# Altium project Melon S3 FPGA.PrjPCB
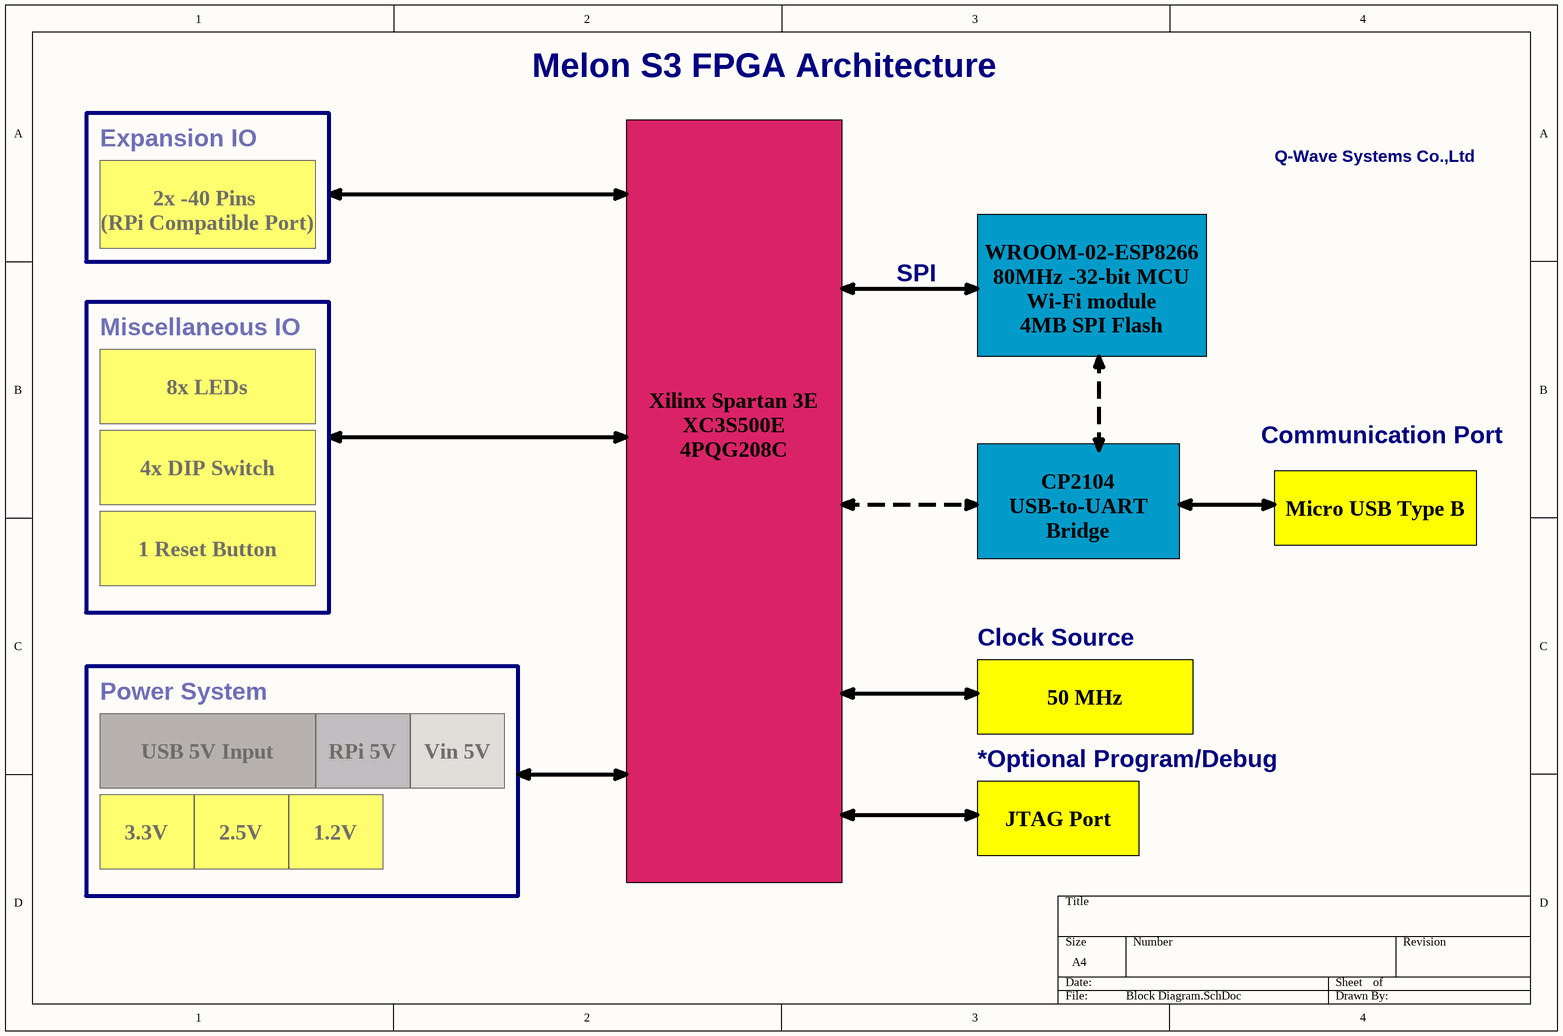
[diagram p0: Block Diagram.SchDoc]
3 sheets, 117 parts. Net scope: global (net labels, ports and power ports of the same name join across sheets).
Board file: Melon S3 FPGA.PcbDoc
Sheets:
  Block Diagram.SchDoc
  ESP-USB.SchDoc
  FPGA.SchDoc

## Sheet Block Diagram.SchDoc: Melon S3 FPGA
size A4; Organization: Q-Wave Systems Co.,Ltd; ProjectName: Melon S3

### Notes on the sheet
- Melon S3 FPGA Architecture
- Expansion IO
- Q-Wave Systems Co.,Ltd
- 2x -40 Pins
  (RPi Compatible Port)
- SPI
- Miscellaneous IO
- WROOM-02-ESP8266
  80MHz -32-bit MCU Wi-Fi module
  4MB SPI Flash
- 8x LEDs
- Communication Port
- 4x DIP Switch
- 1 Reset Button
- CP2104
  USB-to-UART Bridge
- Micro USB Type B
- Clock Source
- Power System
- USB 5V Input
- RPi 5V
- Vin 5V
- 50 MHz
- *Optional Program/Debug
- JTAG Port
- 3.3V
- 2.5V
- 1.2V
- Xilinx Spartan 3E
  XC3S500E
  4PQG208C

## Sheet ESP-USB.SchDoc
size C; SheetNumber: 0; SheetTotal: 0
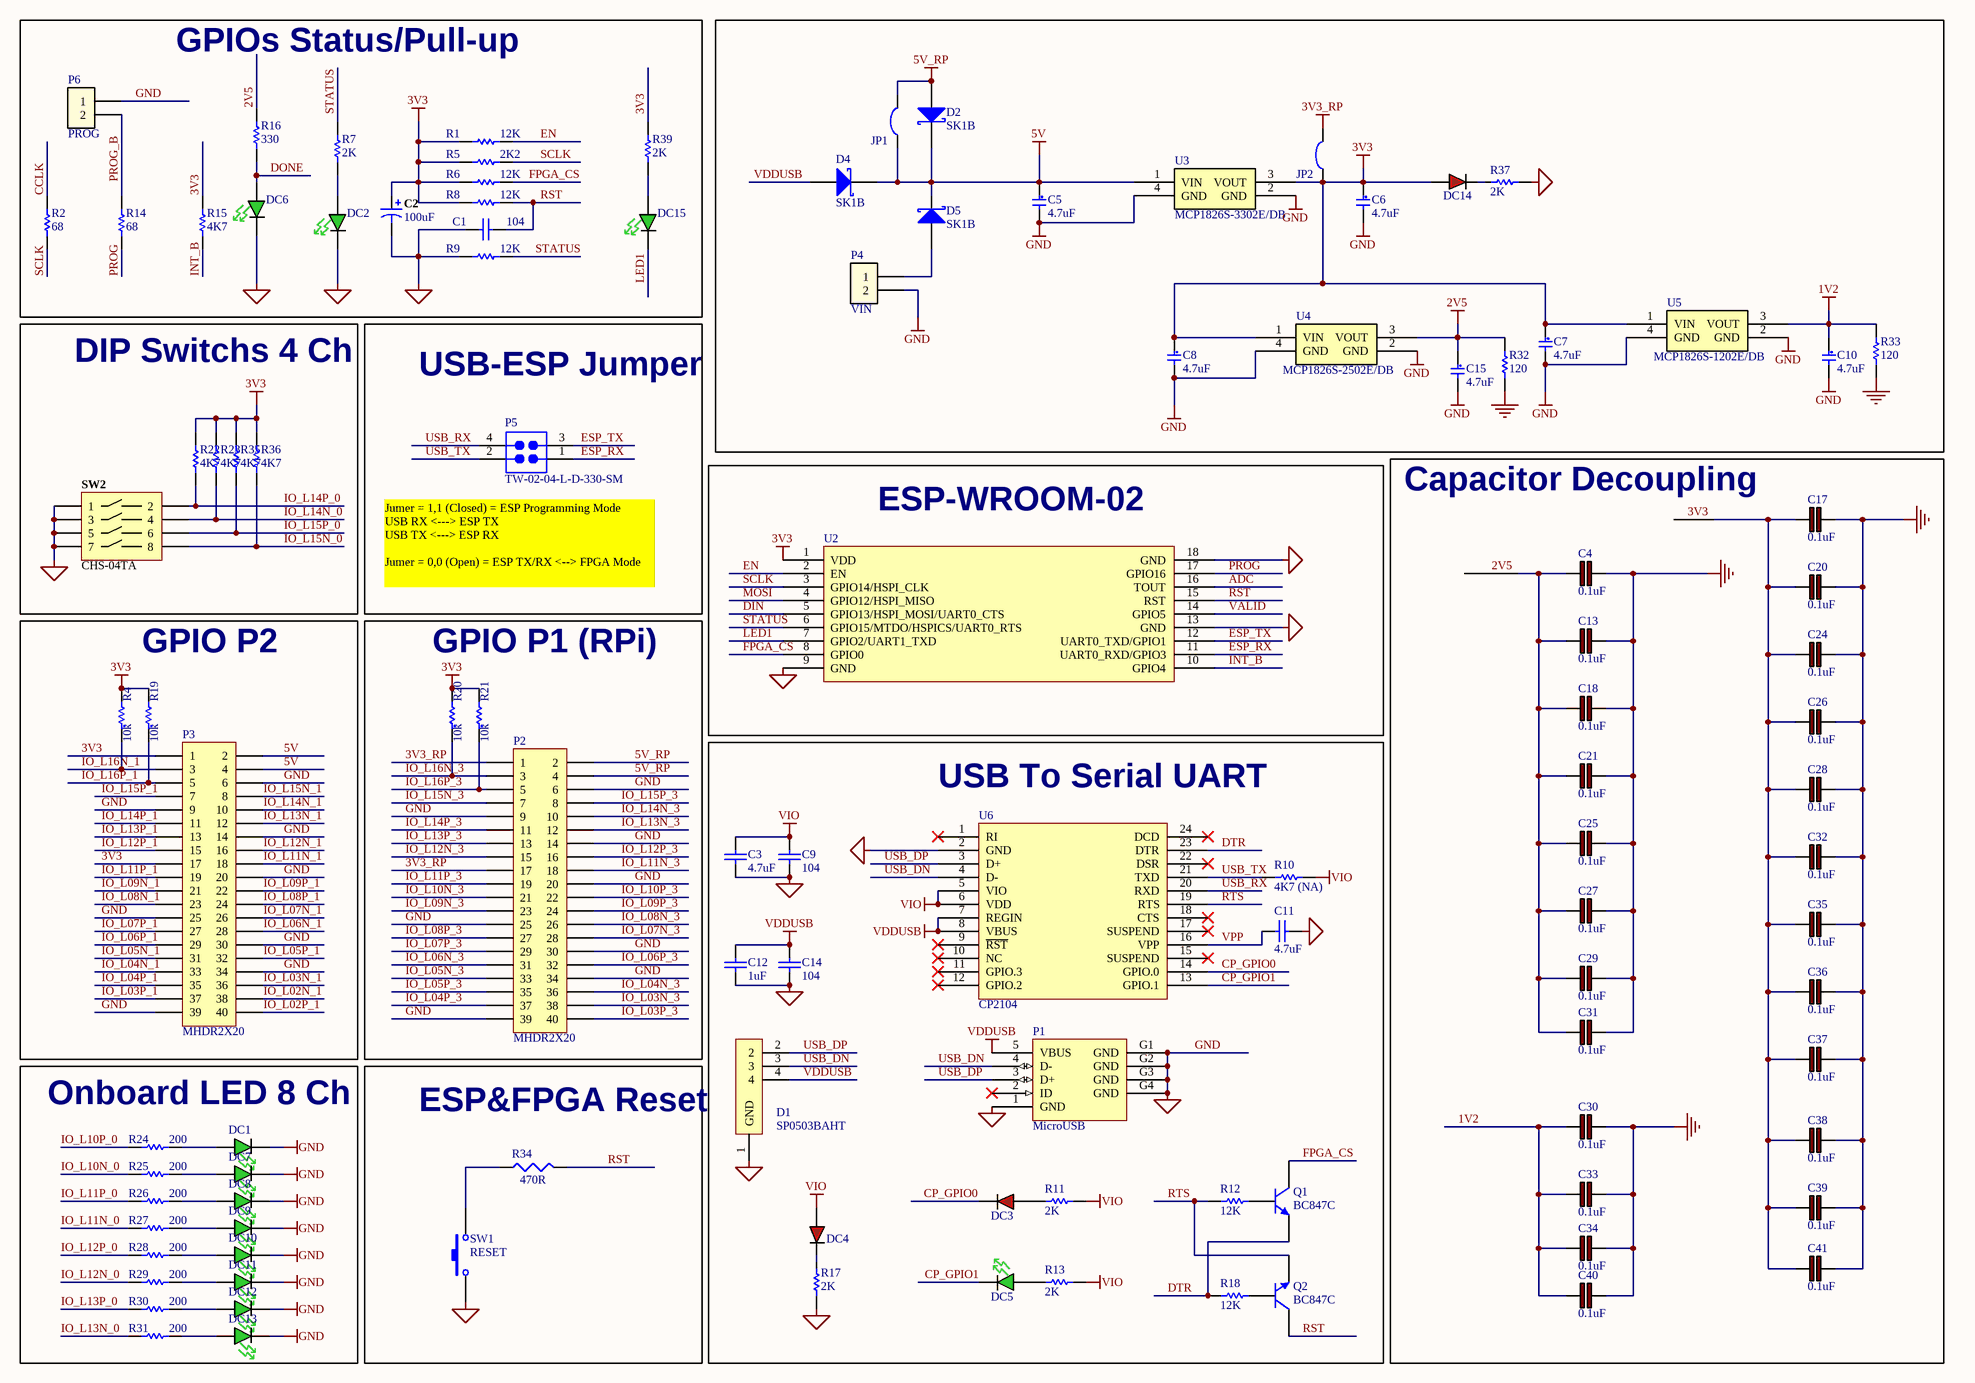
[diagram p1: ESP-USB.SchDoc]

### Parts
C1  104  [C0603 - Marked]
C2  Capacitance: 100uF  [AVX-CAPC3528_V]  (hidden comment: 100 uF Tantalum,)
C3  4.7uF  [C0603 - Marked]
C4  0.1uF  [C0603 - Marked]
C5  4.7uF  [C0603 - Marked]
C6  4.7uF  [C0603 - Marked]
C7  4.7uF  [C0603 - Marked]
C8  4.7uF  [C0603 - Marked]
C9  104  [C0603 - Marked]
C10  4.7uF  [C0603 - Marked]
C11  4.7uF  [C0603 - Marked]
C12  1uF  [C0603 - Marked]
C13  0.1uF  [C0603 - Marked]
C14  104  [C0603 - Marked]
C15  4.7uF  [C0603 - Marked]
C17  0.1uF  [C0603 - Marked]
C18  0.1uF  [C0603 - Marked]
C20  0.1uF  [C0603 - Marked]
C21  0.1uF  [C0603 - Marked]
C24  0.1uF  [C0603 - Marked]
C25  0.1uF  [C0603 - Marked]
C26  0.1uF  [C0603 - Marked]
C27  0.1uF  [C0603 - Marked]
C28  0.1uF  [C0603 - Marked]
C29  0.1uF  [C0603 - Marked]
C30  0.1uF  [C0603 - Marked]
C31  0.1uF  [C0603 - Marked]
C32  0.1uF  [C0603 - Marked]
C33  0.1uF  [C0603 - Marked]
C34  0.1uF  [C0603 - Marked]
C35  0.1uF  [C0603 - Marked]
C36  0.1uF  [C0603 - Marked]
C37  0.1uF  [C0603 - Marked]
C38  0.1uF  [C0603 - Marked]
C39  0.1uF  [C0603 - Marked]
C40  0.1uF  [C0603 - Marked]
C41  0.1uF  [C0603 - Marked]
D1  SP0503BAHT  [SOT143-4]
D2  SK1B  [EDIS_SMA]
D4  SK1B  [EDIS_SMA]
D5  SK1B  [EDIS_SMA]
DC1  (no value)  [LED_0603 - GREEN]
DC2  (no value)  [LED_0603 - GREEN]
DC3  598-8010-107F  [LED_0603 - RED]  (value not drawn)
DC4  598-8010-107F  [LED_0603 - RED]  (value not drawn)
DC5  (no value)  [LED_0603 - GREEN]
DC6  (no value)  [LED_0603 - GREEN]
DC7  (no value)  [LED_0603 - GREEN]
DC8  (no value)  [LED_0603 - GREEN]
DC9  (no value)  [LED_0603 - GREEN]
DC10  (no value)  [LED_0603 - GREEN]
DC11  (no value)  [LED_0603 - GREEN]
DC12  (no value)  [LED_0603 - GREEN]
DC13  (no value)  [LED_0603 - GREEN]
DC14  598-8010-107F  [LED_0603 - RED]  (value not drawn)
DC15  (no value)  [LED_0603 - GREEN]
JP1  Solder Jumper  [SOLDER_JUMPER]  (value not drawn)  (no BOM)
JP2  Solder Jumper  [SOLDER_JUMPER]  (value not drawn)  (no BOM)
P1  MicroUSB  [MICRO-USB-CON]
P2  MHDR2X20  [Raspberry Con]
P3  MHDR2X20  [Raspberry Con]
P4  VIN  [HEADER_2_40_100 THRU SIP]  (no BOM)
P5  TW-02-04-L-D-330-SM  [SMTC-TW-02-04-X-D-330-SM]
P6  PROG  [HEADER_2_40_100 THRU SIP]  (no BOM)
Q1  BC847C  [SOT-23]
Q2  BC847C  [SOT-23]
R1  12K  [R0603]
R2  68  [R0603]
R4  10k  [R0603]
R5  2K2  [R0603]
R6  12K  [R0603]
R7  2K  [R0603]
R8  12K  [R0603]
R9  12K  [R0603]
R10  4K7 (NA)  [R0603]
R11  2K  [R0603]
R12  12K  [R0603]
R13  2K  [R0603]
R14  68  [R0603]
R15  4K7  [R0603]
R16  330  [R0603]
R17  2K  [R0603]
R18  12K  [R0603]
R19  10k  [R0603]
R20  10k  [R0603]
R21  10k  [R0603]
R22  4K7  [R0603]
R23  4K7  [R0603]
R24  200  [R0603]
R25  200  [R0603]
R26  200  [R0603]
R27  200  [R0603]
R28  200  [R0603]
R29  200  [R0603]
R30  200  [R0603]
R31  200  [R0603]
R32  120  [R0603]
R33  120  [R0603]
R34  value 470R  [J1-0603]  (hidden comment: 470)
R35  4K7  [R0603]
R36  4K7  [R0603]
R37  2K  [R0603]
R39  2K  [R0603]
SW1  RESET  [SW_MINI]
SW2  CHS-04TA  [EHS104L]
U2  ESP8266_WROOM_02  [ESP WROOM02-Fit Size]  (value not drawn)
U3  MCP1826S-3302E/DB  [SOT223]
U4  MCP1826S-2502E/DB  [SOT223]
U5  MCP1826S-1202E/DB  [SOT223]
U6  CP2104  [QFN24 - duplicate]

### Blocks framed on the sheet
GPIOs Status/Pull-up: C1 C2 DC2 DC6 DC15 P6 R1 R2 R5-R9 R14-R16 R39
DIP Switchs 4 Ch: R22 R23 R35 R36 SW2
USB-ESP Jumper: P5
ESP-WROOM-02: U2
Capacitor Decoupling: C4 C13 C17 C18 C20 C21 C24-C41
GPIO P2: P3 R4 R19
GPIO P1 (RPi): P2 R20 R21
USB To Serial UART: C3 C9 C11 C12 C14 D1 DC3-DC5 P1 Q1 Q2 R10-R13 R17 R18 U6
Onboard LED 8 Ch: DC1 DC7-DC13 R24-R31
ESP&FPGA Reset: R34 SW1

### Nets
1V2: C10.1 C30.1 C33.1 C34.1 C40.1 R33.1 U5.3(VOUT)
2V5: C4.1 C13.1 C15.1 C18.1 C21.1 C25.1 C27.1 C29.1 C31.1 R16.1 R32.1 U4.3(VOUT)
3V3: C2.1 C6.1 C7.1 C8.1 C17.1 C20.1 C24.1 C26.1 C28.1 C32.1 C35.1 C36.1 C37.1 C38.1 C39.1 C41.1 DC14.A JP2.2 P3.1 P3.17 R1.2 R4.2 R5.2 R6.2 R8.2 R15.1 R19.2 R20.2 R21.2 R22.1 R23.1 R35.1 R36.1 R39.1 U2.1(VDD) U3.3(VOUT) U4.1(VIN) U5.1(VIN)
3V3_RP: JP2.1 P2.1 P2.17
5V: C5.1 D2.2(K) D4.2(K) D5.2(K) JP1.2 P3.2 P3.4 U3.1(VIN)
5V_RP: D2.1(A) JP1.1 P2.2 P2.4
GND: C1.1 C2.2 C3.2 C4.2 C5.2 C6.2 C7.2 C8.2 C9.2 C10.2 C11.2 C12.2 C13.2 C14.2 C15.2 C17.2 C18.2 C20.2 C21.2 C24.2 C25.2 C26.2 C27.2 C28.2 C29.2 C30.2 C31.2 C32.2 C33.2 C34.2 C35.2 C36.2 C37.2 C38.2 C39.2 C40.2 C41.2 D1.1(GND) DC1.C DC2.C DC6.C DC7.C DC8.C DC9.C DC10.C DC11.C DC12.C DC13.C P1.1(GND) P1.G1(GND) P1.G2(GND) P1.G3(GND) P1.G4(GND) P2.6 P2.9 P2.14 P2.20 P2.25 P2.30 P2.34 P2.39 P3.6 P3.9 P3.14 P3.20 P3.25 P3.30 P3.34 P3.39 P4.2 P6.1 R9.2 R17.1 R32.2 R33.2 R37.1 SW1.1 SW2.1 SW2.3 SW2.5 SW2.7 U2.9(GND) U2.13(GND) U2.18(GND) U3.2(GND) U3.4(GND) U4.2(GND) U4.4(GND) U5.2(GND) U5.4(GND) U6.2(GND)  [also labelled DGND]
VDDUSB: C12.1 C14.1 D1.4 D4.1(A) P1.5(VBUS) U6.7(REGIN) U6.8(VBUS)
VIO: C3.1 C9.1 DC4.A R10.2 R11.2 R13.2 U6.5(VIO) U6.6(VDD)
ADC: U2.16(TOUT)
CCLK: R2.1
CP_GPIO0: DC3.C U6.14(GPIO.0)
CP_GPIO1: DC5.C U6.13(GPIO.1)
DIN: U2.5(GPIO13/HSPI_MOSI/UART0_CTS)
DONE: DC6.A R16.2
DTR: Q1.2(E) R18.2 U6.23(DTR)
EN: R1.1 U2.2(EN)
ESP_RX: P5.1 U2.11(UART0_RXD/GPIO3)
ESP_TX: P5.3 U2.12(UART0_TXD/GPIO1)
FPGA_CS: Q1.3(C) R6.1 U2.8(GPIO0)
INT_B: R15.2 U2.10(GPIO4)
IO_L02N_1: P3.38
IO_L02P_1: P3.40
IO_L03N_1: P3.36
IO_L03N_3: P2.38
IO_L03P_1: P3.37
IO_L03P_3: P2.40
IO_L04N_1: P3.33
IO_L04N_3: P2.36
IO_L04P_1: P3.35
IO_L04P_3: P2.37
IO_L05N_1: P3.31
IO_L05N_3: P2.33
IO_L05P_1: P3.32
IO_L05P_3: P2.35
IO_L06N_1: P3.28
IO_L06N_3: P2.31
IO_L06P_1: P3.29
IO_L06P_3: P2.32
IO_L07N_1: P3.26
IO_L07N_3: P2.28
IO_L07P_1: P3.27
IO_L07P_3: P2.29
IO_L08N_1: P3.23
IO_L08N_3: P2.26
IO_L08P_1: P3.24
IO_L08P_3: P2.27
IO_L09N_1: P3.21
IO_L09N_3: P2.23
IO_L09P_1: P3.22
IO_L09P_3: P2.24
IO_L10N_0: R25.2
IO_L10N_3: P2.21
IO_L10P_0: R24.2
IO_L10P_3: P2.22
IO_L11N_0: R27.2
IO_L11N_1: P3.18
IO_L11N_3: P2.18
IO_L11P_0: R26.2
IO_L11P_1: P3.19
IO_L11P_3: P2.19
IO_L12N_0: R29.2
IO_L12N_1: P3.16
IO_L12N_3: P2.15
IO_L12P_0: R28.2
IO_L12P_1: P3.15
IO_L12P_3: P2.16
IO_L13N_0: R31.2
IO_L13N_1: P3.12
IO_L13N_3: P2.12
IO_L13P_0: R30.2
IO_L13P_1: P3.13
IO_L13P_3: P2.13
IO_L14N_0: R23.2 SW2.4
IO_L14N_1: P3.10
IO_L14N_3: P2.10
IO_L14P_0: R22.2 SW2.2
IO_L14P_1: P3.11
IO_L14P_3: P2.11
IO_L15N_0: R36.2 SW2.8
IO_L15N_1: P3.8
IO_L15N_3: P2.7
IO_L15P_0: R35.2 SW2.6
IO_L15P_1: P3.7
IO_L15P_3: P2.8
IO_L16N_1: P3.3 R4.1
IO_L16N_3: P2.3 R20.1
IO_L16P_1: P3.5 R19.1
IO_L16P_3: P2.5 R21.1
LED1: DC15.C U2.7(GPIO2/UART1_TXD)
MOSI: U2.4(GPIO12/HSPI_MISO)
PROG: R14.2 U2.17(GPIO16)
PROG_B: P6.2 R14.1
RST: C1.2 Q2.3(C) R8.1 R34.2 U2.15(RST)
RTS: Q2.2(E) R12.2 U6.19(RTS)
SCLK: R2.2 R5.1 U2.3(GPIO14/HSPI_CLK)
STATUS: R7.1 R9.1 U2.6(GPIO15/MTDO/HSPICS/UART0_RTS)
USB_DN: D1.3 P1.4(D-) U6.4(D-)
USB_DP: D1.2 P1.3(D+) U6.3(D+)
USB_RX: P5.4 U6.20(RXD)
USB_TX: P5.2 R10.1 U6.21(TXD)
VALID: U2.14(GPIO5)
VPP: C11.1 U6.16(VPP)
NetD5_1: D5.1(A) P4.1
NetDC1_A: DC1.A R24.1
NetDC2_A: DC2.A R7.2
NetDC3_A: DC3.A R11.1
NetDC4_C: DC4.C R17.2
NetDC5_A: DC5.A R13.1
NetDC7_A: DC7.A R25.1
NetDC8_A: DC8.A R26.1
NetDC9_A: DC9.A R27.1
NetDC10_A: DC10.A R28.1
NetDC11_A: DC11.A R29.1
NetDC12_A: DC12.A R30.1
NetDC13_A: DC13.A R31.1
NetDC14_C: DC14.C R37.2
NetDC15_A: DC15.A R39.2
NetQ1_1: Q1.1(B) R12.1
NetQ2_1: Q2.1(B) R18.1
NetR34_1: R34.1 SW1.2

Not connected (* = marked no-connect by the designer): P1 2(ID)*; U6 1(RI)* 9(~{RST})* 10(NC)* 11(GPIO.3)* 12(GPIO.2)* 15(SUSPEND)* 17(SUSPEND)* 18(CTS)* 22(DSR)* 24(DCD)*

### Notes on the sheet
- (near P5) Jumer = 1,1 (Closed) = ESP Programming Mode
  USB RX <---> ESP TX
  USB TX <---> ESP RX
  Jumer = 0,0 (Open) = ESP TX/RX <--> FPGA Mode

### Library data of the parts
C1 C9 C14 = Cap Semi: Capacitor 0603; MFG: KEMET; MFG P/N: C0603C104J5RACTU; Supplier1: ES; Supplier1 Price: 0.6
C2 = CMP-0279-00001-1: Capacitor, Tantalum, 100uF 10% 20V MCCT-B (3528); PartNumber: TAJB106K020R; Manufacturer: AVX; Polarity: Polarized; PackageDescription: 2-Pin SMT Capacitor, 3.5 x 2.8 mm Body; ComponentLink1URL: http://www.avx.com/; PackageReference: CAPC3528; ComponentLink2Description: Datasheet; Technology: Tantalum; ComponentLink2URL: http://www.avx.com/docs/Catalogs/taj.pdf; Tolerance: 10%; ComponentLink1Description: Manufacturer URL; Rated Voltage: 20V; DatasheetVersion: Jun-13; Mounting Technology: Surface Mount; Manufacturer_PN: TAJB106K020R; Manufacturer Part Number: TAJB106K020R
C3 C11 = Cap: Capacitor 0603; MFG: KEMET; MFG P/N: C0603C475K8PACTU; Supplier1: ES; Supplier1 Price: 1.86
C4 C13 C17 C18 C20 C21 C24-C41 = CAP: Capacitor
C5-C8 C10 C15 = C0603 - GRM188R60J475KE19D: 4.7uF 6.3volts X5R 10% (MLCC) - SMD/SMT 0603; Manufacturer: Murata Electronics North America; Capacitance: 4.7µF; Voltage - Rated: 6.3V; Value: 4.7uF; Supplier 1: Digi-Key; Supplier Part Number 1: 490-3297-1-ND; Manufacturer Part Number: GRM188R60J475KE19D; RoHS: RoHS Compliant; Category: Capacitors; Stock 1: 614848; Pricing 1: 1=0.19, 10=0.132, 50=0.076, 100=0.0627, 250=0.05284, 500=0.04426, 1000=0.03633 (USD); Tolerance: ±10%; Package / Case: 0603 (1608 Metric); Packaging: Cut Tape (CT); ComponentLink1URL: http://search.murata.co.jp/Ceramy/image/img/PDF/ENG/GRM188R60J475KE19.pdf; ComponentLink1Description: http://search.murata.co.jp/Ceramy/image/img/PDF/ENG/GRM188R60J475KE19.pdf; Temperature Coefficient: X5R; Mounting Type: Surface Mount, MLCC; Operating Temperature: -55°C ~ 85°C; Applications: General Purpose; Ratings: -; Size / Dimension: 0.063" L x 0.031" W (1.60mm x 0.80mm); Height - Seated (Max): -; Thickness (Max): 0.035" (0.90mm); Lead Spacing: -; Features: -; Lead Style: -
C12 = Cap Semi: Capacitor 0603; MFG: KEMET; MFG P/N: GRM188R61H105KAALD; Supplier1: ES; Supplier1 Price: 1.31
D1 = SP0503BAHT: TVS DIODE 5.5VWM 8.5VC SOT143; MFG P/N: SP0503BAHTG; MFG: GTK; Supplier1: Digikey; Supplier1 Price: 24.28
D2 D4 D5 = D Schottky: Schottky Diode; MFG: EIC; Supplier1: ES; Supplier1 Price: 3.01; MFG P/N: SK1B
DC1 DC2 DC5-DC13 DC15 = APT1608CGCK: LED 1.6X0.8MM 570NM GRN CLR SMD; Manufacturer: Kingbright Corp; Current - Test: 20mA; Wavelength - Peak: 574nm; Millicandela Rating: 50mcd; Voltage - Forward (Vf) Typ: 2.1V; Lens Type: Clear; Lens Style/Size: Rectangle with Flat Top, 1.2mm x 0.8mm; Viewing Angle: 120°; Supplier 1: Digi-Key; Supplier Part Number 1: 754-1116-1-ND; Manufacturer Part Number: APT1608CGCK; RoHS: RoHS Compliant; Category: Optoelectronics; Stock 1: 98122; Pricing 1: 1=0.2, 10=0.153, 25=0.1224, 100=0.1105, 250=0.102, 500=0.0918 (USD); Color: Green; Luminous Flux @ Current - Test: -; Wavelength - Dominant: 570nm; Size / Dimension: 1.60mm L x 0.80mm W; Height: 0.75mm; Package / Case: 0603 (1608 Metric); Mounting Type: Surface Mount; Packaging: Cut Tape (CT); ComponentLink1URL: http://www.us.kingbright.com/images/catalog/SPEC/APT1608CGCK.pdf; ComponentLink1Description: http://www.us.kingbright.com/images/catalog/SPEC/APT1608CGCK.pdf
DC3 DC4 DC14 = LED0603 - 598-8010-107F: LED ALINGAP RED CLEAR 0603 SMD; Manufacturer: Dialight; Current - Test: 20mA; Wavelength - Dominant: 635nm; Millicandela Rating: 40mcd; Voltage - Forward (Vf) Typ: 2.2V; Lens Style/Size: Rectangle with Flat Top, 1.1mm x 0.8mm; Viewing Angle: 140°; Accept Replacement: YES - Water Clear; Supplier 1: Digi-Key; Manufacturer Part Number: 598-8010-107F; RoHS: RoHS Compliant; Category: Optoelectronics; Stock 1: 37578; Pricing 1: 1=0.45, 10=0.33, 25=0.264, 100=0.1749, 250=0.1452, 500=0.1056, 1000=0.0825 (USD); Color: Red; Luminous Flux @ Current - Test: -; Wavelength - Peak: -; Lens Type: Clear; Size / Dimension: 1.60mm L x 0.80mm W; Height: 0.70mm; Package / Case: 0603 (1608 Metric); Mounting Type: Surface Mount; Packaging: Digi-Reel®; ComponentLink1URL: http://media.digikey.com/pdf/Data%20Sheets/Dialight%20PDFs/598_Series_0603_Pkg.pdf; ComponentLink1Description: http://media.digikey.com/pdf/Data%20Sheets/Dialight%20PDFs/598_Series_0603_Pkg.pdf; Supplier Part Number 1: 350-2029-6-ND
JP1 JP2 = Solder Jumper: Solder/Configuration Jumper; Manufacturer: n/a; Manufacturer Part Number: n/a; Source: n/a; Source Part Number: n/a; ROHS Certificate: n/a
P1 = ESOC004: Micro USB 5Pins,Female B type Right Angle, SMT; MFG P/N: MRUMRB05FTKTY-30U; MFG: GTK; Supplier1: ES; Supplier1 Price: 15.35
P2 P3 = MHDR2X20: Header, 20-Pin, Dual row; LatestRevisionDate: 17-Jul-2002; LatestRevisionNote: Re-released for DXP Platform.; Publisher: Altium Limited
P4 P6 = Header2: Header 2 pin
P5 = CMP-1029-00319-1: SMT Board Stacker, Vertical, -55 to 125 degC, 2 mm Pitch, 4-Pin, Male, RoHS; Manufacturer: Samtec; Pitch: 2 mm; PackageDescription: High Temp 2mm SMT Board Stacking Terminal Strip ASM; ComponentLink1Description: Manufacturer URL; PackageVersion: CL, 3/1993; ComponentLink3URL: http://www.samtec.com/documents/webfiles/cpdf/TW-XX-XX-XXX-X-XXX-SM-XXX-XX-MKT1.pdf; Temperature Range: -55 to 125 degC; Orientation: Vertical; ComponentLink2Description: Datasheet; RoHS: True; ComponentLink1URL: http://www.samtec.com; ComponentLink3Description: Package Specification; DatasheetVersion: F-214; PartNumber: TW-02-04-L-D-330-SM; PackageReference: TW-02-04-X-D-330-SM; ComponentLink2URL: http://d2a072wq521u33.cloudfront.net/catalog_english//TW_SM.PDF; Mounting Technology: Surface Mount
Q1 Q2 = NPN: NPN Bipolar Transistor; MFG: PHILIPS/NXP; MFG P/N: BC847C,215; Supplier1: ES; Supplier1 Price: 0.53
R1 R2 R6-R9 R12 R14-R16 R18 R22 R23 R32 R33 R35 R36 R39 = Res Semi: Resistor 0603; MFG: ROHM; MFG P/N: MCR03ERTF1202; Supplier1: Digikey; Supplier1 Price: 0.4
R4 R19-R21 = R0603 - CRCW060310K0FKEA: 10k Thick Film Resistors - SMD 1/10watt 10Kohms 1%; Manufacturer: Vishay Dale; Power (Watts): 0.1W, 1/10W; Temperature Coefficient: ±100ppm/°C; Manufacturer Part Number: CRCW060310K0FKEA; Value: 10k; Supplier 1: Digi-Key; RoHS: RoHS Compliant; Category: Resistors; Stock 1: 997856; Pricing 1: 10=0.081, 50=0.0436, 200=0.0251, 1000=0.01711 (USD); Resistance (Ohms): 10K; Composition: Thick Film; Features: -; Tolerance: ±1%; Size / Dimension: 0.061" L x 0.033" W (1.55mm x 0.85mm); Height: 0.020" (0.50mm); Packaging: Cut Tape (CT); Package / Case: 0603 (1608 Metric); ComponentLink1URL: http://www.vishay.com/doc?20035; ComponentLink1Description: http://www.vishay.com/doc?20035; Supplier Part Number 1: 541-10.0KHCT-ND; Number of Terminations: 2
R5 = Res Semi: Resistor 0603; MFG: ROHM; MFG P/N: MCR03ERTF2201; Supplier1: Digikey; Supplier1 Price: 0.4
R10 = Res Semi: Resistor 0603; MFG P/N: NA
R11 R13 R17 R37 = Res Semi: Resistor 0603; MFG: ROHM; MFG P/N: MCR03ERTF2001; Supplier1: Digikey; Supplier1 Price: 0.4
R24-R31 = ERJ-3EKF2000V: RES 200 OHM 1/10W 1% 0603 SMD; Manufacturer: Panasonic - ECG; Power (Watts): 0.1W, 1/10W; Temperature Coefficient: ±100ppm/°C; Manufacturer Part Number: ERJ-3EKF2000V; Value: RES 200 OHM 1/10W 1% 0603 SMD; Supplier 1: Digi-Key; Supplier Part Number 1: P200HCT-ND; RoHS: RoHS Compliant; Category: Resistors; Stock 1: 1279595; Pricing 1: 1=0.04, 50=0.015, 100=0.0114, 250=0.00844, 500=0.00624, 1000=0.00416 (USD); Resistance (Ohms): 200; Composition: Thick Film; Features: -; Tolerance: ±1%; Size / Dimension: 0.063" L x 0.031" W (1.60mm x 0.80mm); Height: 0.018" (0.45mm); Lead Style: Surface Mount (SMD - SMT); Packaging: Cut Tape (CT); Package / Case: 0603 (1608 Metric); ComponentLink1URL: http://industrial.panasonic.com/www-cgi/jvcr13pz.cgi?E+PZ+3+AOA0002+ERJ3EKF2000V+7+WW; ComponentLink1Description: http://industrial.panasonic.com/www-cgi/jvcr13pz.cgi?E+PZ+3+AOA0002+ERJ3EKF2000V+7+WW
R34 = Res3: Resistor; Published: 8-Jun-2000; LatestRevisionDate: 29-May-2009; LatestRevisionNote: IPC-7351 Footprint Added.; PackageReference: J1-0603; Publisher: Altium Limited; PackageDescription: Chip Resistor
SW1 = SW-PB: Tact Switch; MFG: ALPS; MFG P/N: SKRKAHE010; Supplier1: Mouser; Supplier1 Price: 19.06
SW2 = CHS-04TA: SWITCH DIP 4-POS SLIDE SMD 6V; Manufacturer: Copal Electronics Inc; Circuit: SPST; Number of Positions: 4; Contact Rating @ Voltage: 0.1A @ 6VDC; Actuator Type: Standard; Actuator Level: Flush; Washable: Yes; Supplier 1: Digi-Key; Manufacturer Part Number: CHS-04TA; RoHS: RoHS Compliant; Category: Switches; Stock 1: 2000; Pricing 1: 500=1.33876, 1000=1.1475, 5000=1.05188 (USD); Mounting Type: Surface Mount; Orientation: Top Actuated; ComponentLink1URL: http://copal-electronics.info/en/0008e/0267f.pdf; ComponentLink1Description: http://copal-electronics.info/en/0008e/0267f.pdf; Supplier Part Number 1: 563-1007-2-ND; Manufacturer_PN: CHS-04TA
U2 = ESP8266 WROOM 02: WiFi Serial Transceiver Module (ESP8266); MFG P/N: ESP-WROOM-02; MFG: ESPRESSIF; Supplier1 Price: 95.34; Supplier1: stock
U3 = REG - MCP1826S-3302E/DB: LDO REG 1A 3.3V SOT223-3; Manufacturer: Microchip Technology; Regulator Topology: Positive Fixed; Voltage - Input: Up to 6V; Voltage - Dropout (Typical): 0.25V @ 1A; Number of Regulators: 1; Current - Output: 1A (Min); Value: MCP1826S-3302E/DB; Supplier 1: Digi-Key; Supplier Part Number 1: MCP1826S-3302E/DB-ND; Manufacturer Part Number: MCP1826S-3302E/DB; RoHS: RoHS Compliant; Category: Integrated Circuits (ICs); Stock 1: 2041; Pricing 1: 1=0.74, 10=0.68, 25=0.57, 100=0.52 (USD); Voltage - Output: 3.3V; Current - Limit (Min): -; Operating Temperature: -40°C ~ 125°C; Mounting Type: Surface Mount; Package / Case: TO-261-4, TO-261AA; Supplier Device Package: SOT-223-3; Packaging: Tube; ComponentLink1URL: http://ww1.microchip.com/downloads/en/DeviceDoc/22057a.pdf; ComponentLink1Description: http://ww1.microchip.com/downloads/en/DeviceDoc/22057a.pdf
U4 = MCP1826S-1202E/DB: IC LDO REG 1A 2.5V SOT223-3; Manufacturer: Microchip Technology; Regulator Topology: Positive Fixed; Voltage - Input: Up to 6V; Voltage - Dropout (Typical): 0.25V @ 1A; Number of Regulators: 1; Current - Output: 1A (Min); Value: MCP1826S-2502E/DB; Supplier 1: Digi-Key; Supplier Part Number 1: MCP1826S-2502E/DB-ND; Manufacturer Part Number: MCP1826S-1202E/DB; RoHS: RoHS Compliant; Category: Integrated Circuits (ICs); Stock 1: 2041; Pricing 1: 1=0.74, 10=0.68, 25=0.57, 100=0.52 (USD); Voltage - Output: 2.5V; Current - Limit (Min): -; Operating Temperature: -40°C ~ 125°C; Mounting Type: Surface Mount; Package / Case: TO-261-4, TO-261AA; Supplier Device Package: SOT-223-3; Packaging: Tube; ComponentLink1URL: http://ww1.microchip.com/downloads/en/DeviceDoc/22057a.pdf; ComponentLink1Description: http://ww1.microchip.com/downloads/en/DeviceDoc/22057a.pdf
U5 = MCP1826S-1202E/DB: IC LDO REG 1A 1.2V SOT223-3; Manufacturer: Microchip Technology; Regulator Topology: Positive Fixed; Voltage - Input: Up to 6V; Voltage - Dropout (Typical): 0.25V @ 1A; Number of Regulators: 1; Current - Output: 1A (Min); Value: MCP1826S-1202E/DB; Supplier 1: Digi-Key; Supplier Part Number 1: MCP1826S-1202E/DB-ND; Manufacturer Part Number: MCP1826S-1202E/DB; RoHS: RoHS Compliant; Category: Integrated Circuits (ICs); Stock 1: 2041; Pricing 1: 1=0.74, 10=0.68, 25=0.57, 100=0.52 (USD); Voltage - Output: 1.2V; Current - Limit (Min): -; Operating Temperature: -40°C ~ 125°C; Mounting Type: Surface Mount; Package / Case: TO-261-4, TO-261AA; Supplier Device Package: SOT-223-3; Packaging: Tube; ComponentLink1URL: http://ww1.microchip.com/downloads/en/DeviceDoc/22057a.pdf; ComponentLink1Description: http://ww1.microchip.com/downloads/en/DeviceDoc/22057a.pdf
U6 = CP2104: IC SGL USB-TO-UART BRIDGE 24QFN; MFG P/N: CP2104-F03-GM; MFG: Silicon Labs; Supplier1: Digikey; Supplier1 Price: 61.5

## Sheet FPGA.SchDoc
size B
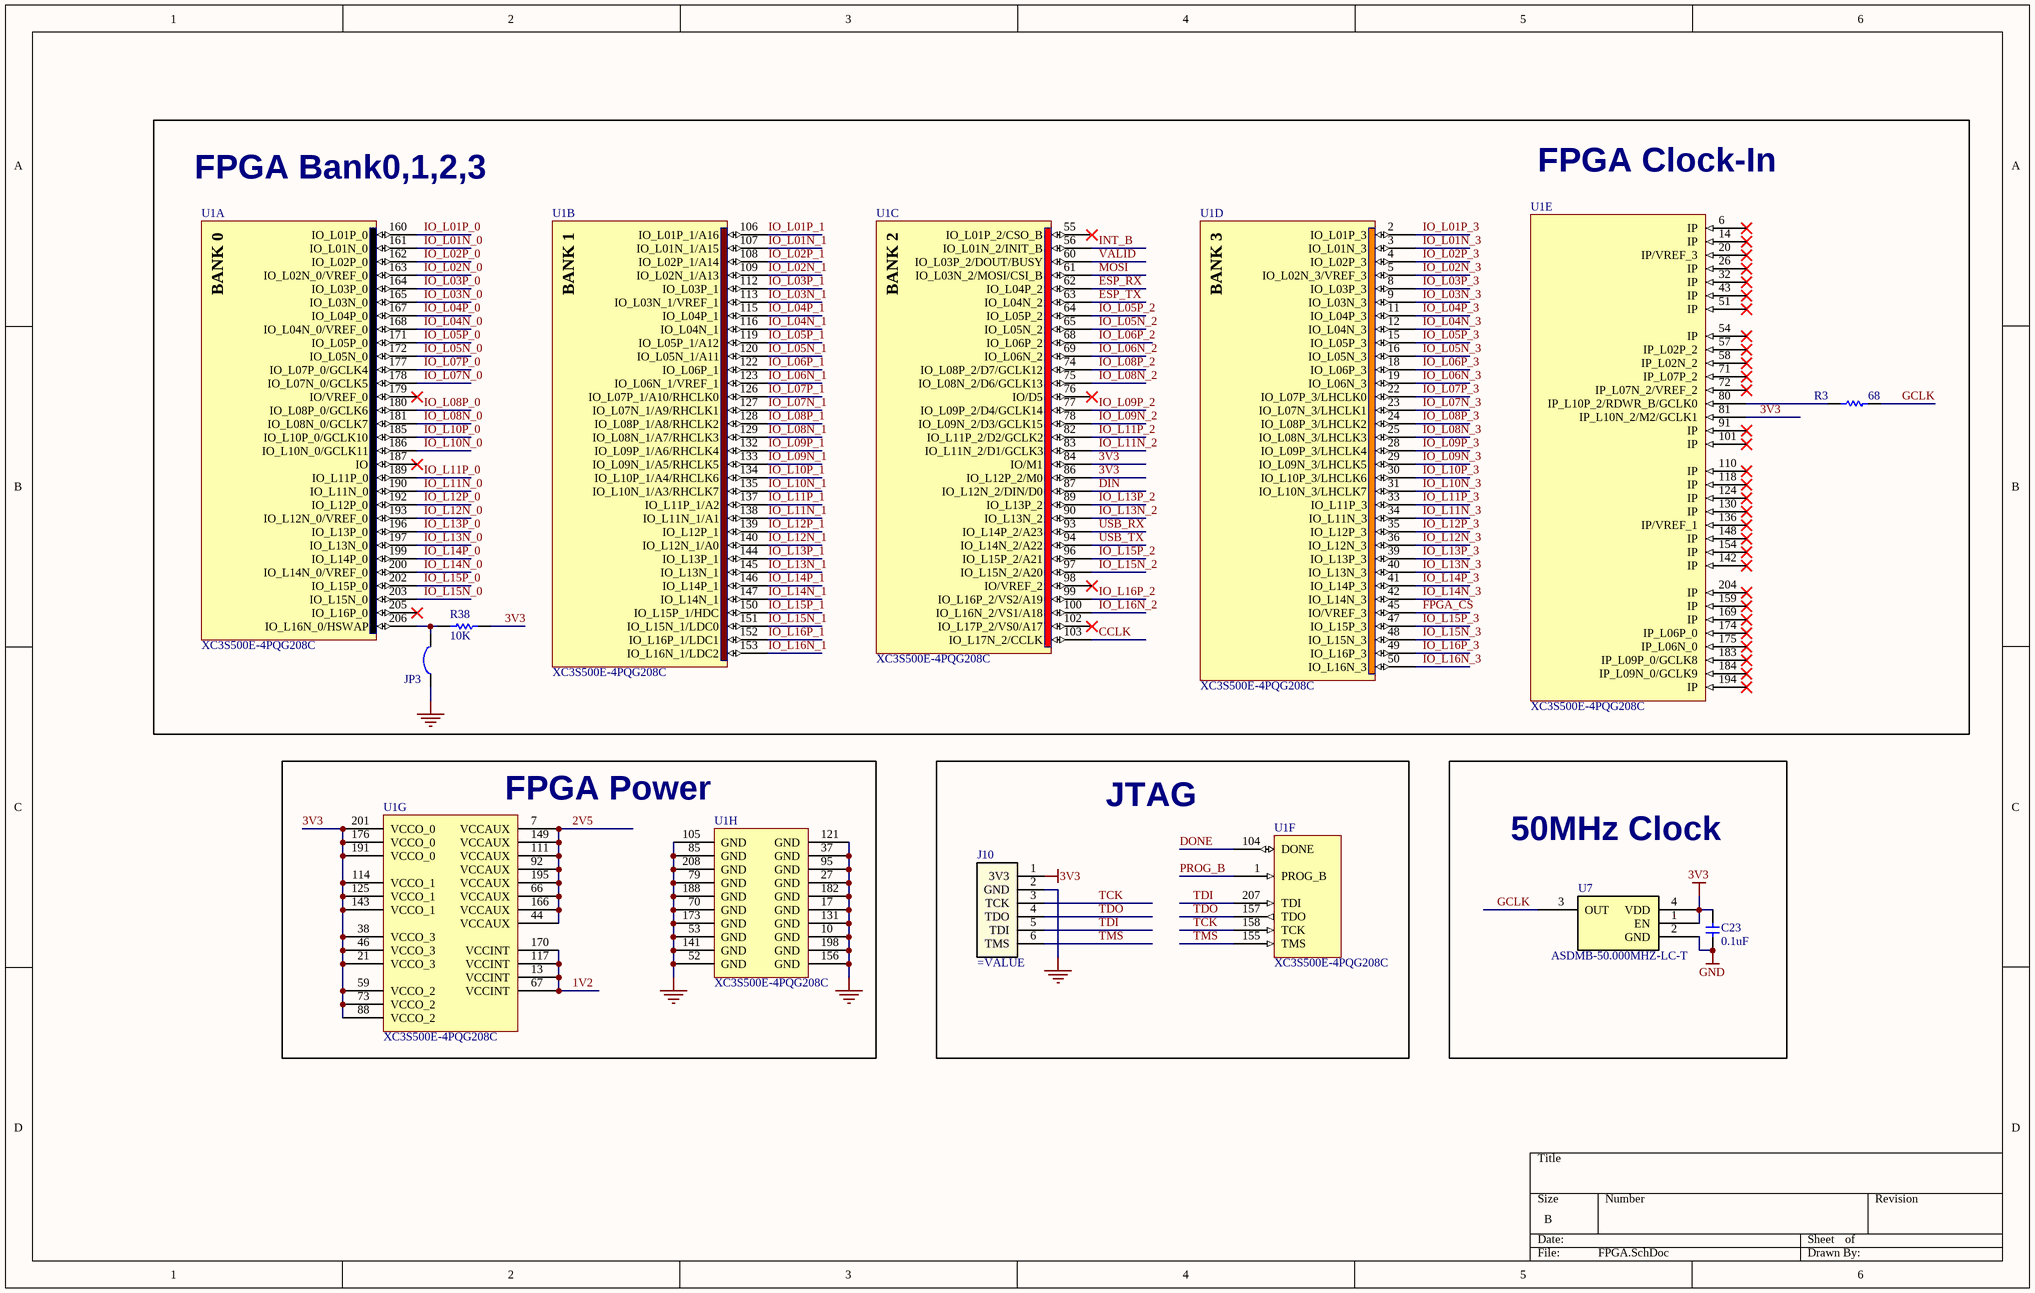
[diagram p2: FPGA.SchDoc]

### Parts
C23  0.1uF  [C0603]
J10  (no value)  [JTAG - Digilent HS1]
JP3  Solder Jumper  [SOLDER_JUMPER]  (value not drawn)  (no BOM)
R3  68  [R0603]
R38  10K  [R0603]
U1  XC3S500E-4PQG208C  [PQG208_N]  (parts A,B,C,D,E,F,G,H of 8)
U7  ASDMB-50.000MHZ-LC-T  [ASDMB - osc]

### Blocks framed on the sheet
FPGA Power: U1
JTAG: J10 U1
50MHz Clock: C23 U7

### Nets
1V2: U1.13(VCCINT) U1.67(VCCINT) U1.117(VCCINT) U1.170(VCCINT)
2V5: U1.7(VCCAUX) U1.44(VCCAUX) U1.66(VCCAUX) U1.92(VCCAUX) U1.111(VCCAUX) U1.149(VCCAUX) U1.166(VCCAUX) U1.195(VCCAUX)
3V3: C23.2 J10.1(3V3) R38.2 U1.21(VCCO_3) U1.38(VCCO_3) U1.46(VCCO_3) U1.59(VCCO_2) U1.73(VCCO_2) U1.81(IP_L10N_2/M2/GCLK1) U1.84(IO/M1) U1.86(IO_L12P_2/M0) U1.88(VCCO_2) U1.114(VCCO_1) U1.125(VCCO_1) U1.143(VCCO_1) U1.176(VCCO_0) U1.191(VCCO_0) U1.201(VCCO_0) U7.1(EN) U7.4(VDD)
GND: C23.1 J10.2(GND) JP3.2 U1.10(GND) U1.17(GND) U1.27(GND) U1.37(GND) U1.52(GND) U1.53(GND) U1.70(GND) U1.79(GND) U1.85(GND) U1.95(GND) U1.105(GND) U1.121(GND) U1.131(GND) U1.141(GND) U1.156(GND) U1.173(GND) U1.182(GND) U1.188(GND) U1.198(GND) U1.208(GND) U7.2(GND)
CCLK: U1.103(IO_L17N_2/CCLK)
DIN: U1.87(IO_L12N_2/DIN/D0)
DONE: U1.104(DONE)
ESP_RX: U1.62(IO_L04P_2)
ESP_TX: U1.63(IO_L04N_2)
FPGA_CS: U1.45(IO/VREF_3)
GCLK: R3.1 U7.3(OUT)
INT_B: U1.56(IO_L01N_2/INIT_B)
IO_L01N_0: U1.161(IO_L01N_0)
IO_L01N_1: U1.107(IO_L01N_1/A15)
IO_L01N_3: U1.3(IO_L01N_3)
IO_L01P_0: U1.160(IO_L01P_0)
IO_L01P_1: U1.106(IO_L01P_1/A16)
IO_L01P_3: U1.2(IO_L01P_3)
IO_L02N_0: U1.163(IO_L02N_0/VREF_0)
IO_L02N_1: U1.109(IO_L02N_1/A13)
IO_L02N_3: U1.5(IO_L02N_3/VREF_3)
IO_L02P_0: U1.162(IO_L02P_0)
IO_L02P_1: U1.108(IO_L02P_1/A14)
IO_L02P_3: U1.4(IO_L02P_3)
IO_L03N_0: U1.165(IO_L03N_0)
IO_L03N_1: U1.113(IO_L03N_1/VREF_1)
IO_L03N_3: U1.9(IO_L03N_3)
IO_L03P_0: U1.164(IO_L03P_0)
IO_L03P_1: U1.112(IO_L03P_1)
IO_L03P_3: U1.8(IO_L03P_3)
IO_L04N_0: U1.168(IO_L04N_0/VREF_0)
IO_L04N_1: U1.116(IO_L04N_1)
IO_L04N_3: U1.12(IO_L04N_3)
IO_L04P_0: U1.167(IO_L04P_0)
IO_L04P_1: U1.115(IO_L04P_1)
IO_L04P_3: U1.11(IO_L04P_3)
IO_L05N_0: U1.172(IO_L05N_0)
IO_L05N_1: U1.120(IO_L05N_1/A11)
IO_L05N_2: U1.65(IO_L05N_2)
IO_L05N_3: U1.16(IO_L05N_3)
IO_L05P_0: U1.171(IO_L05P_0)
IO_L05P_1: U1.119(IO_L05P_1/A12)
IO_L05P_2: U1.64(IO_L05P_2)
IO_L05P_3: U1.15(IO_L05P_3)
IO_L06N_1: U1.123(IO_L06N_1/VREF_1)
IO_L06N_2: U1.69(IO_L06N_2)
IO_L06N_3: U1.19(IO_L06N_3)
IO_L06P_1: U1.122(IO_L06P_1)
IO_L06P_2: U1.68(IO_L06P_2)
IO_L06P_3: U1.18(IO_L06P_3)
IO_L07N_0: U1.178(IO_L07N_0/GCLK5)
IO_L07N_1: U1.127(IO_L07N_1/A9/RHCLK1)
IO_L07N_3: U1.23(IO_L07N_3/LHCLK1)
IO_L07P_0: U1.177(IO_L07P_0/GCLK4)
IO_L07P_1: U1.126(IO_L07P_1/A10/RHCLK0)
IO_L07P_3: U1.22(IO_L07P_3/LHCLK0)
IO_L08N_0: U1.181(IO_L08N_0/GCLK7)
IO_L08N_1: U1.129(IO_L08N_1/A7/RHCLK3)
IO_L08N_2: U1.75(IO_L08N_2/D6/GCLK13)
IO_L08N_3: U1.25(IO_L08N_3/LHCLK3)
IO_L08P_0: U1.180(IO_L08P_0/GCLK6)
IO_L08P_1: U1.128(IO_L08P_1/A8/RHCLK2)
IO_L08P_2: U1.74(IO_L08P_2/D7/GCLK12)
IO_L08P_3: U1.24(IO_L08P_3/LHCLK2)
IO_L09N_1: U1.133(IO_L09N_1/A5/RHCLK5)
IO_L09N_2: U1.78(IO_L09N_2/D3/GCLK15)
IO_L09N_3: U1.29(IO_L09N_3/LHCLK5)
IO_L09P_1: U1.132(IO_L09P_1/A6/RHCLK4)
IO_L09P_2: U1.77(IO_L09P_2/D4/GCLK14)
IO_L09P_3: U1.28(IO_L09P_3/LHCLK4)
IO_L10N_0: U1.186(IO_L10N_0/GCLK11)
IO_L10N_1: U1.135(IO_L10N_1/A3/RHCLK7)
IO_L10N_3: U1.31(IO_L10N_3/LHCLK7)
IO_L10P_0: U1.185(IO_L10P_0/GCLK10)
IO_L10P_1: U1.134(IO_L10P_1/A4/RHCLK6)
IO_L10P_3: U1.30(IO_L10P_3/LHCLK6)
IO_L11N_0: U1.190(IO_L11N_0)
IO_L11N_1: U1.138(IO_L11N_1/A1)
IO_L11N_2: U1.83(IO_L11N_2/D1/GCLK3)
IO_L11N_3: U1.34(IO_L11N_3)
IO_L11P_0: U1.189(IO_L11P_0)
IO_L11P_1: U1.137(IO_L11P_1/A2)
IO_L11P_2: U1.82(IO_L11P_2/D2/GCLK2)
IO_L11P_3: U1.33(IO_L11P_3)
IO_L12N_0: U1.193(IO_L12N_0/VREF_0)
IO_L12N_1: U1.140(IO_L12N_1/A0)
IO_L12N_3: U1.36(IO_L12N_3)
IO_L12P_0: U1.192(IO_L12P_0)
IO_L12P_1: U1.139(IO_L12P_1)
IO_L12P_3: U1.35(IO_L12P_3)
IO_L13N_0: U1.197(IO_L13N_0)
IO_L13N_1: U1.145(IO_L13N_1)
IO_L13N_2: U1.90(IO_L13N_2)
IO_L13N_3: U1.40(IO_L13N_3)
IO_L13P_0: U1.196(IO_L13P_0)
IO_L13P_1: U1.144(IO_L13P_1)
IO_L13P_2: U1.89(IO_L13P_2)
IO_L13P_3: U1.39(IO_L13P_3)
IO_L14N_0: U1.200(IO_L14N_0/VREF_0)
IO_L14N_1: U1.147(IO_L14N_1)
IO_L14N_3: U1.42(IO_L14N_3)
IO_L14P_0: U1.199(IO_L14P_0)
IO_L14P_1: U1.146(IO_L14P_1)
IO_L14P_3: U1.41(IO_L14P_3)
IO_L15N_0: U1.203(IO_L15N_0)
IO_L15N_1: U1.151(IO_L15N_1/LDC0)
IO_L15N_2: U1.97(IO_L15N_2/A20)
IO_L15N_3: U1.48(IO_L15N_3)
IO_L15P_0: U1.202(IO_L15P_0)
IO_L15P_1: U1.150(IO_L15P_1/HDC)
IO_L15P_2: U1.96(IO_L15P_2/A21)
IO_L15P_3: U1.47(IO_L15P_3)
IO_L16N_1: U1.153(IO_L16N_1/LDC2)
IO_L16N_2: U1.100(IO_L16N_2/VS1/A18)
IO_L16N_3: U1.50(IO_L16N_3)
IO_L16P_1: U1.152(IO_L16P_1/LDC1)
IO_L16P_2: U1.99(IO_L16P_2/VS2/A19)
IO_L16P_3: U1.49(IO_L16P_3)
MOSI: U1.61(IO_L03N_2/MOSI/CSI_B)
PROG_B: U1.1(PROG_B)
TCK: J10.3(TCK) U1.158(TCK)
TDI: J10.5(TDI) U1.207(TDI)
TDO: J10.4(TDO) U1.157(TDO)
TMS: J10.6(TMS) U1.155(TMS)
USB_RX: U1.93(IO_L14P_2/A23)
USB_TX: U1.94(IO_L14N_2/A22)
VALID: U1.60(IO_L03P_2/DOUT/BUSY)
NetJP3_1: JP3.1 R38.1 U1.206(IO_L16N_0/HSWAP)
NetR3_2: R3.2 U1.80(IP_L10P_2/RDWR_B/GCLK0)

Not connected (* = marked no-connect by the designer): U1 6(IP)* 14(IP)* 20(IP/VREF_3)* 26(IP)* 32(IP)* 43(IP)* 51(IP)* 54(IP)* 55(IO_L01P_2/CSO_B)* 57(IP_L02P_2)* 58(IP_L02N_2)* 71(IP_L07P_2)* 72(IP_L07N_2/VREF_2)* 76(IO/D5)* 91(IP)* 98(IO/VREF_2)* 101(IP)* 102(IO_L17P_2/VS0/A17)* 110(IP)* 118(IP)* 124(IP)* 130(IP)* 136(IP/VREF_1)* 142(IP)* 148(IP)* 154(IP)* 159(IP)* 169(IP)* 174(IP_L06P_0)* 175(IP_L06N_0)* 179(IO/VREF_0)* 183(IP_L09P_0/GCLK8)* 184(IP_L09N_0/GCLK9)* 187(IO)* 194(IP)* 204(IP)* 205(IO_L16P_0)*

### Notes on the sheet
- (near U1) FPGA Bank0,1,2,3
- (near U1) FPGA Clock-In
- (in symbol XC3S500E-4PQG208C, part A) BANK 0
- (in symbol XC3S500E-4PQG208C, part B) BANK 1
- (in symbol XC3S500E-4PQG208C, part C) BANK 2
- (in symbol XC3S500E-4PQG208C, part D) BANK 3

### Library data of the parts
C23 = GRM188R71H104KA93D: CAP CER .1UF 50V 10% X7R 0603; Manufacturer: Murata Electronics North America; Capacitance: 0.1µF; Manufacturer Part Number: GRM188R71H104KA93D; Value: CAP CER .1UF 50V 10% X7R 0603; Supplier 1: Digi-Key; Supplier Part Number 1: 490-1519-1-ND; RoHS: RoHS Compliant; Category: Capacitors; Stock 1: 9370695; Pricing 1: 10=0.037, 100=0.0221, 500=0.01276, 1000=0.00884 (USD); Voltage - Rated: 50V; Tolerance: ±10%; Temperature Coefficient: X7R; Mounting Type: Surface Mount, MLCC; Operating Temperature: -55°C ~ 125°C; Features: -; Applications: General Purpose; Ratings: -; Package / Case: 0603 (1608 Metric); Size / Dimension: 0.063" L x 0.031" W (1.60mm x 0.80mm); Lead Spacing: -; Thickness: 0.80mm; Packaging: Cut Tape (CT); Lead Style: -; ComponentLink1URL: http://search.murata.co.jp/Ceramy/image/img/PDF/ENG/GRM188R71H104KA93.pdf; ComponentLink1Description: http://search.murata.co.jp/Ceramy/image/img/PDF/ENG/GRM188R71H104KA93.pdf
J10 = JTAG - Digilent HS1: DIGILENT - 410-205 - PROGRAMMING CABLE, JTAG HS1, USB2; Manufacturer: Samtec; Manufacturer Part Number: TSW-106-08-G-S-RA; Lead Time: 0 weeks; Peak Solder Temperature: 260 deg C; MSL Level Min: N/R; Connector Type: Header, Unshrouded; Number of Positions: 6; Number of Positions Loaded: All; Pitch: 0.100" (2.54mm); Supplier 1: Arrow; RoHS: CHINA ROHS: Compliant / EU ROHS: Compliant; Stock 1: 0; Pricing 1: 0=0.2649 (USD); ComponentLink1URL: http://components.arrow.com/partservice/dataview/altium/2677508S3639200N1004?apiKey=aa438727d59eed98c4bed826d8d949c84cb5e685b92bf87346a0226bd2658797; ComponentLink1Description: http://components.arrow.com/partservice/dataview/altium/2677508S3639200N1004?apiKey=aa438727d59eed98c4bed826d8d949c84cb5e685b92bf87346a0226bd2658797; Supplier Part Number 1: 2677508S3639200N1004; Package Quantity: 1; Termination Finish: Au/Ni; MSL Level Max: N/R; MSL (Moisture Sensitivity Level): N/R; China ROHS Lead (X -> above / O -> below threshold): O; China ROHS Mercury (X -> above / O -> below threshold): O; China ROHS Cadmium (X -> above / O -> below threshold): O; China ROHS Hex Chromium (X -> above / O -> below threshold): O; China ROHS PBB (X -> above / O -> below threshold): O; China ROHS PBDE (X -> above / O -> below threshold): O; EU_ROHS_PROD_EXEMPTION_BY_SUPP: N/R; Supplier 2: Digi-Key; Category: Connectors, Interconnects; Stock 2: 0; Pricing 2: 1=0.94, 10=0.841, 100=0.6926, 500=0.5475, 1000=0.46999, 5000=0.42877, 10000=0.41228 (USD); Contact Type: Male Pin; Number of Rows: 1; Row Spacing: -; Contact Mating Length: 0.230" (5.84mm); Mounting Type: Through Hole; Termination: Solder; Fastening Type: -; Features: -; Contact Finish: Gold; Contact Finish Thickness: 10µin (0.25µm); Color: Black; Packaging: Bulk; ComponentLink2URL: http://www.samtec.com/documents/webfiles/cpdf/TSW-XXX-XX-XXX-X-XX-XXX-MKT.pdf; ComponentLink2Description: http://www.samtec.com/documents/webfiles/cpdf/TSW-XXX-XX-XXX-X-XX-XXX-MKT.pdf; Supplier Part Number 2: SAM1038-06-ND
JP3 = Solder Jumper: Solder/Configuration Jumper; Manufacturer: n/a; Manufacturer Part Number: n/a; Source: n/a; Source Part Number: n/a; ROHS Certificate: n/a
R3 R38 = Res Semi: as R1 on sheet ESP-USB; Supplier1: Digikey; Supplier1 Price: 0.4
U1 = XC3S500E-4PQG208C: Spartan-3E 1.2V FPGA, 158 User I/Os, 208-Pin PQFP, Standard Performance, Commercial Grade, Pb-Free; Published: 6-Jun-2005; LatestRevisionDate: 30-Oct-2009; LatestRevisionNote: Updated to datasheet version 3.8 Aug-2009.; DatasheetVersion: ver3.8, Aug-2009; PackageVersion: ver1.2, Jun-2004; PackageReference: PQG208; Publisher: Altium Limited; PackageDescription: 208-Pin Plastic Quad Flat Pack (PQG208) - Pb-Free; Supplier 1: Digi-Key; Supplier Part Number 1: 122-1520-ND; Code_JEDEC: MS-029-FA-1; ComponentLink1Description: Spartan-3E Datasheet; ComponentLink1URL: http://www.xilinx.com/support/documentation/data_sheets/ds312.pdf; ComponentLink2Description: PQG208 Package Drawing; ComponentLink2URL: http://www.xilinx.com/support/documentation/package_specs/pq208.pdf; ComponentLink3Description: Spartan-3E Documents; ComponentLink3URL: http://www.xilinx.com/support/documentation/spartan-3e.htm; ComponentLink4Description: Xilinx.com Home; ComponentLink4URL: http://www.xilinx.com
U7 = ASDMB-50.000MHZ-LC-T: OSC MEMS 50.000 MHZ SMD; Manufacturer: Abracon Corporation; Frequency: 50MHz; Function: Tri-State (Output Enable); Output: CMOS; Voltage - Supply: 1.8 V ~ 3.3 V; Frequency Stability: ±50ppm; Current - Supply (Max): 16mA; Current - Supply (Disable) (Max): 15µA; Supplier 1: Digi-Key; Manufacturer Part Number: ASDMB-50.000MHZ-LC-T; RoHS: RoHS Compliant; Category: Crystals and Oscillators; Stock 1: 967; Pricing 1: 1=1.69, 10=1.463, 50=1.2826, 100=1.0125, 500=0.855 (USD); Type: MEMS (Silicon); Operating Temperature: -40°C ~ 85°C; Mounting Type: Surface Mount; Size / Dimension: 0.098" L x 0.079" W (2.50mm x 2.00mm); Height: 0.035" (0.90mm); Package / Case: 4-SMD, No Lead (DFN, LCC); Packaging: Cut Tape (CT); ComponentLink1URL: http://www.abracon.com/Oscillators/ASDMB.pdf; ComponentLink1Description: http://www.abracon.com/Oscillators/ASDMB.pdf; Supplier Part Number 1: 535-11738-1-ND; Value: ASDMB-50.000MHZ-LC-T

## Nets that join several sheets
1V2: ESP-USB (7 pins), FPGA (U1.13 U1.67 U1.117 U1.170)
2V5: ESP-USB (12 pins), FPGA (8 pins)
3V3: ESP-USB (38 pins), FPGA (20 pins)
GND: ESP-USB (91 pins), FPGA (24 pins)
CCLK: ESP-USB (R2.1), FPGA (U1.103)
DIN: ESP-USB (U2.5), FPGA (U1.87)
DONE: ESP-USB (DC6.A R16.2), FPGA (U1.104)
ESP_RX: ESP-USB (P5.1 U2.11), FPGA (U1.62)
ESP_TX: ESP-USB (P5.3 U2.12), FPGA (U1.63)
FPGA_CS: ESP-USB (Q1.3 R6.1 U2.8), FPGA (U1.45)
INT_B: ESP-USB (R15.2 U2.10), FPGA (U1.56)
IO_L02N_1: ESP-USB (P3.38), FPGA (U1.109)
IO_L02P_1: ESP-USB (P3.40), FPGA (U1.108)
IO_L03N_1: ESP-USB (P3.36), FPGA (U1.113)
IO_L03N_3: ESP-USB (P2.38), FPGA (U1.9)
IO_L03P_1: ESP-USB (P3.37), FPGA (U1.112)
IO_L03P_3: ESP-USB (P2.40), FPGA (U1.8)
IO_L04N_1: ESP-USB (P3.33), FPGA (U1.116)
IO_L04N_3: ESP-USB (P2.36), FPGA (U1.12)
IO_L04P_1: ESP-USB (P3.35), FPGA (U1.115)
IO_L04P_3: ESP-USB (P2.37), FPGA (U1.11)
IO_L05N_1: ESP-USB (P3.31), FPGA (U1.120)
IO_L05N_3: ESP-USB (P2.33), FPGA (U1.16)
IO_L05P_1: ESP-USB (P3.32), FPGA (U1.119)
IO_L05P_3: ESP-USB (P2.35), FPGA (U1.15)
IO_L06N_1: ESP-USB (P3.28), FPGA (U1.123)
IO_L06N_3: ESP-USB (P2.31), FPGA (U1.19)
IO_L06P_1: ESP-USB (P3.29), FPGA (U1.122)
IO_L06P_3: ESP-USB (P2.32), FPGA (U1.18)
IO_L07N_1: ESP-USB (P3.26), FPGA (U1.127)
IO_L07N_3: ESP-USB (P2.28), FPGA (U1.23)
IO_L07P_1: ESP-USB (P3.27), FPGA (U1.126)
IO_L07P_3: ESP-USB (P2.29), FPGA (U1.22)
IO_L08N_1: ESP-USB (P3.23), FPGA (U1.129)
IO_L08N_3: ESP-USB (P2.26), FPGA (U1.25)
IO_L08P_1: ESP-USB (P3.24), FPGA (U1.128)
IO_L08P_3: ESP-USB (P2.27), FPGA (U1.24)
IO_L09N_1: ESP-USB (P3.21), FPGA (U1.133)
IO_L09N_3: ESP-USB (P2.23), FPGA (U1.29)
IO_L09P_1: ESP-USB (P3.22), FPGA (U1.132)
IO_L09P_3: ESP-USB (P2.24), FPGA (U1.28)
IO_L10N_0: ESP-USB (R25.2), FPGA (U1.186)
IO_L10N_3: ESP-USB (P2.21), FPGA (U1.31)
IO_L10P_0: ESP-USB (R24.2), FPGA (U1.185)
IO_L10P_3: ESP-USB (P2.22), FPGA (U1.30)
IO_L11N_0: ESP-USB (R27.2), FPGA (U1.190)
IO_L11N_1: ESP-USB (P3.18), FPGA (U1.138)
IO_L11N_3: ESP-USB (P2.18), FPGA (U1.34)
IO_L11P_0: ESP-USB (R26.2), FPGA (U1.189)
IO_L11P_1: ESP-USB (P3.19), FPGA (U1.137)
IO_L11P_3: ESP-USB (P2.19), FPGA (U1.33)
IO_L12N_0: ESP-USB (R29.2), FPGA (U1.193)
IO_L12N_1: ESP-USB (P3.16), FPGA (U1.140)
IO_L12N_3: ESP-USB (P2.15), FPGA (U1.36)
IO_L12P_0: ESP-USB (R28.2), FPGA (U1.192)
IO_L12P_1: ESP-USB (P3.15), FPGA (U1.139)
IO_L12P_3: ESP-USB (P2.16), FPGA (U1.35)
IO_L13N_0: ESP-USB (R31.2), FPGA (U1.197)
IO_L13N_1: ESP-USB (P3.12), FPGA (U1.145)
IO_L13N_3: ESP-USB (P2.12), FPGA (U1.40)
IO_L13P_0: ESP-USB (R30.2), FPGA (U1.196)
IO_L13P_1: ESP-USB (P3.13), FPGA (U1.144)
IO_L13P_3: ESP-USB (P2.13), FPGA (U1.39)
IO_L14N_0: ESP-USB (R23.2 SW2.4), FPGA (U1.200)
IO_L14N_1: ESP-USB (P3.10), FPGA (U1.147)
IO_L14N_3: ESP-USB (P2.10), FPGA (U1.42)
IO_L14P_0: ESP-USB (R22.2 SW2.2), FPGA (U1.199)
IO_L14P_1: ESP-USB (P3.11), FPGA (U1.146)
IO_L14P_3: ESP-USB (P2.11), FPGA (U1.41)
IO_L15N_0: ESP-USB (R36.2 SW2.8), FPGA (U1.203)
IO_L15N_1: ESP-USB (P3.8), FPGA (U1.151)
IO_L15N_3: ESP-USB (P2.7), FPGA (U1.48)
IO_L15P_0: ESP-USB (R35.2 SW2.6), FPGA (U1.202)
IO_L15P_1: ESP-USB (P3.7), FPGA (U1.150)
IO_L15P_3: ESP-USB (P2.8), FPGA (U1.47)
IO_L16N_1: ESP-USB (P3.3 R4.1), FPGA (U1.153)
IO_L16N_3: ESP-USB (P2.3 R20.1), FPGA (U1.50)
IO_L16P_1: ESP-USB (P3.5 R19.1), FPGA (U1.152)
IO_L16P_3: ESP-USB (P2.5 R21.1), FPGA (U1.49)
MOSI: ESP-USB (U2.4), FPGA (U1.61)
PROG_B: ESP-USB (P6.2 R14.1), FPGA (U1.1)
USB_RX: ESP-USB (P5.4 U6.20), FPGA (U1.93)
USB_TX: ESP-USB (P5.2 R10.1 U6.21), FPGA (U1.94)
VALID: ESP-USB (U2.14), FPGA (U1.60)